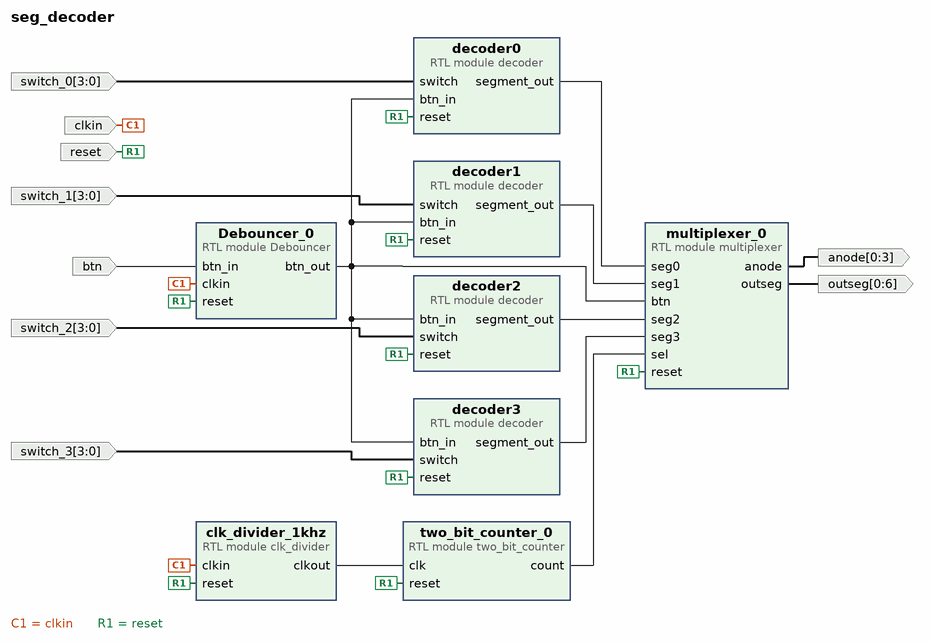
[diagram p0: block diagram of the top level]
# Vivado block design seg_decoder, xc7a35tcpg236-1, Vivado 2019.2
create_bd_design seg_decoder

create_bd_port -dir I -type clk clkin
create_bd_port -dir I -type rst reset
create_bd_port -dir I -from 3 -to 0 switch_1
create_bd_port -dir I -from 3 -to 0 switch_0
create_bd_port -dir O -from 0 -to 3 anode
create_bd_port -dir O -from 0 -to 6 outseg
create_bd_port -dir I btn
create_bd_port -dir I -from 3 -to 0 switch_2
create_bd_port -dir I -from 3 -to 0 switch_3

create_bd_cell -type module -reference Debouncer Debouncer_0
create_bd_cell -type module -reference two_bit_counter two_bit_counter_0
create_bd_cell -type module -reference clk_divider clk_divider_1khz
create_bd_cell -type module -reference decoder decoder1
create_bd_cell -type module -reference decoder decoder2
create_bd_cell -type module -reference decoder decoder0
create_bd_cell -type module -reference decoder decoder3
create_bd_cell -type module -reference multiplexer multiplexer_0

# ---- connections ----

connect_bd_net -net clkin_0_1 [get_bd_ports clkin] [get_bd_pins Debouncer_0/clkin] [get_bd_pins clk_divider_1khz/clkin]
connect_bd_net -net reset_0_1 [get_bd_ports reset] \
  [get_bd_pins Debouncer_0/reset] [get_bd_pins two_bit_counter_0/reset] [get_bd_pins clk_divider_1khz/reset] \
  [get_bd_pins decoder1/reset] [get_bd_pins decoder2/reset] [get_bd_pins decoder0/reset] [get_bd_pins decoder3/reset] \
  [get_bd_pins multiplexer_0/reset]
connect_bd_net [get_bd_pins Debouncer_0/btn_out] \
  [get_bd_pins decoder1/btn_in] [get_bd_pins decoder2/btn_in] [get_bd_pins decoder0/btn_in] [get_bd_pins decoder3/btn_in] \
  [get_bd_pins multiplexer_0/btn]
connect_bd_net [get_bd_pins clk_divider_1khz/clkout] [get_bd_pins two_bit_counter_0/clk]
connect_bd_net [get_bd_ports switch_0] [get_bd_pins decoder0/switch]
connect_bd_net -net decoder_2_segment_out [get_bd_pins decoder0/segment_out] [get_bd_pins multiplexer_0/seg0]
connect_bd_net [get_bd_pins two_bit_counter_0/count] [get_bd_pins multiplexer_0/sel]
connect_bd_net [get_bd_pins multiplexer_0/anode] [get_bd_ports anode]
connect_bd_net [get_bd_pins multiplexer_0/outseg] [get_bd_ports outseg]
connect_bd_net -net decoder_0_segment_out [get_bd_pins decoder1/segment_out] [get_bd_pins multiplexer_0/seg1]
connect_bd_net -net decoder_3_segment_out [get_bd_pins decoder3/segment_out] [get_bd_pins multiplexer_0/seg3]
connect_bd_net -net decoder_1_segment_out [get_bd_pins decoder2/segment_out] [get_bd_pins multiplexer_0/seg2]
connect_bd_net [get_bd_ports switch_1] [get_bd_pins decoder1/switch]
connect_bd_net [get_bd_ports switch_2] [get_bd_pins decoder2/switch]
connect_bd_net [get_bd_ports switch_3] [get_bd_pins decoder3/switch]
connect_bd_net [get_bd_ports btn] [get_bd_pins Debouncer_0/btn_in]

validate_bd_design
save_bd_design
